# Altium schematic sheet Button_Board.SchDoc
size 127 x 76 mm; SheetNumber: 1; SheetTotal: 1
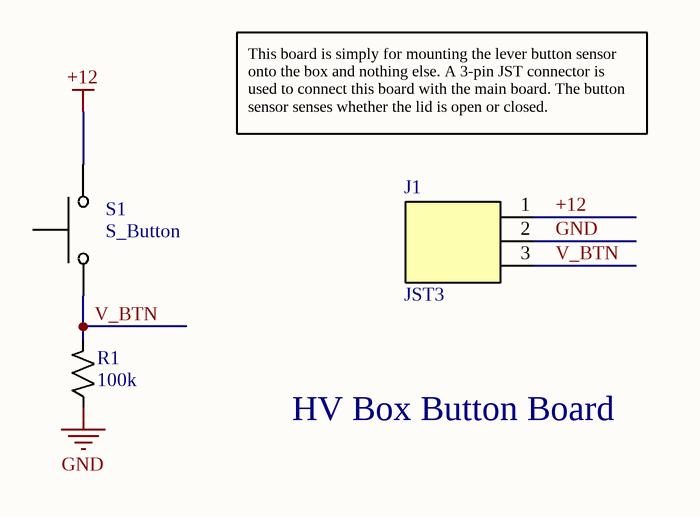
[diagram p0: Button_Board.SchDoc]

## Parts
J1  JST3  [JST_3]
R1  100k  [0603_RES]
S1  S_Button  [BUTTON]

## Nets
+12: J1.1(Sig1) S1.1
GND: J1.2(Sig2) R1.1
V_BTN: J1.3(NC) R1.2 S1.2

## Notes on the sheet
- (near J1) This board is simply for mounting the lever button sensor onto the box and nothing else. A 3-pin JST connector is used to connect this board with the main board. The button sensor senses whether the lid is open or closed.
- HV Box Button Board

## Library data of the parts
J1 = J_JST_3: Jack JST 3-pin
R1 = R_100kOhm_0603_1%: Resistor 100 kOhm 0603 1%
S1 = S_Button: Switch Button